# Altium schematic sheet air_cylinder_control.SchDoc
size A3; DocumentNumber: 9; Revision: V1.0; SheetNumber: 9; SheetTotal: 9; Rule: PcbType=ProtelPcb
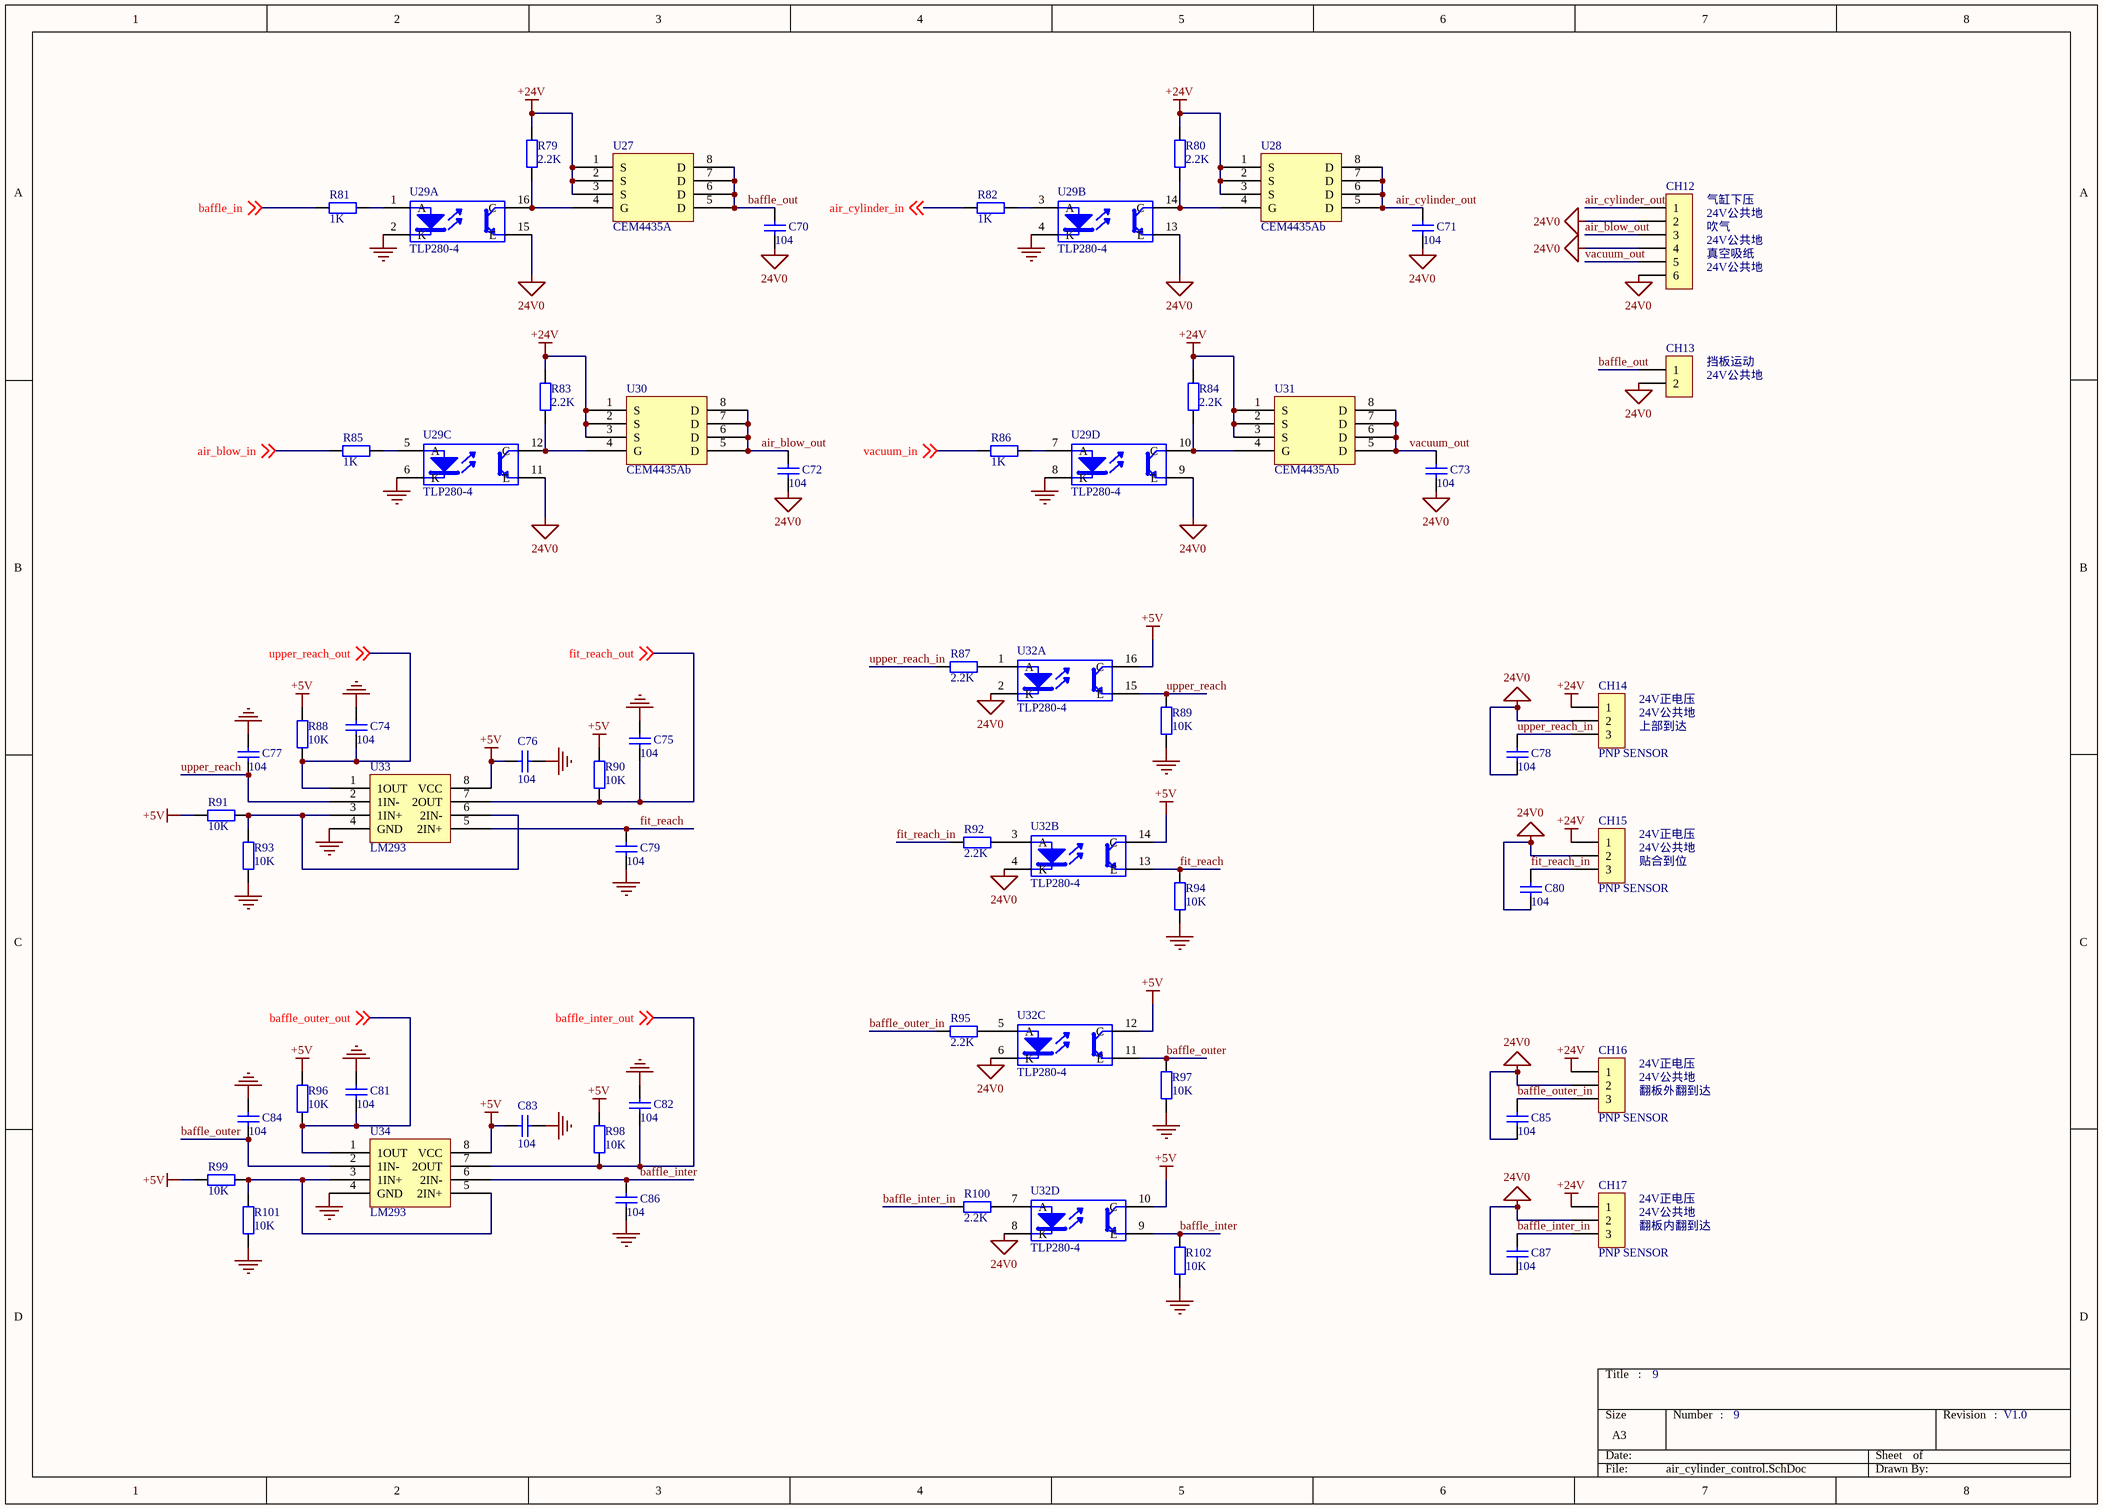
[diagram p0: air_cylinder_control.SchDoc]

## Parts
C70  value 104  [0805]  (hidden comment: Capb)
C71  value 104  [0805]  (hidden comment: Capb)
C72  value 104  [0805]  (hidden comment: Capb)
C73  value 104  [0805]  (hidden comment: Capb)
C74  value 104  [0805]  (hidden comment: Cap)
C75  value 104  [0805]  (hidden comment: Cap)
C76  value 104  [0805]  (hidden comment: Cap)
C77  value 104  [0805]  (hidden comment: Cap)
C78  value 104  [0805]  (hidden comment: Capb)
C79  value 104  [0805]  (hidden comment: Cap)
C80  value 104  [0805]  (hidden comment: Capb)
C81  value 104  [0805]  (hidden comment: Cap)
C82  value 104  [0805]  (hidden comment: Cap)
C83  value 104  [0805]  (hidden comment: Cap)
C84  value 104  [0805]  (hidden comment: Cap)
C85  value 104  [0805]  (hidden comment: Capb)
C86  value 104  [0805]  (hidden comment: Cap)
C87  value 104  [0805]  (hidden comment: Capb)
CH12  HEADER1X6  [CH3.96-6PIN]  (value not drawn)
CH13  HEADER1X2  [CH3.96-2PIN]  (value not drawn)
CH14  HEADER1X3  [CH3.96-3PIN]  (value not drawn)
CH15  HEADER1X3  [CH3.96-3PIN]  (value not drawn)
CH16  HEADER1X3  [CH3.96-3PIN]  (value not drawn)
CH17  HEADER1X3  [CH3.96-3PIN]  (value not drawn)
R79  value 2.2K  [0805]  (hidden comment: Res2)
R80  value 2.2K  [0805]  (hidden comment: Res2)
R81  value 1K  [0805]  (hidden comment: Res2)
R82  value 1K  [0805]  (hidden comment: Res2)
R83  value 2.2K  [0805]  (hidden comment: Res2)
R84  value 2.2K  [0805]  (hidden comment: Res2)
R85  value 1K  [0805]  (hidden comment: Res2)
R86  value 1K  [0805]  (hidden comment: Res2)
R87  value 2.2K  [0805]  (hidden comment: Res2)
R88  value 10K  [0805]  (hidden comment: Res2)
R89  value 10K  [0805]  (hidden comment: Res2)
R90  value 10K  [0805]  (hidden comment: Res2)
R91  value 10K  [0805]  (hidden comment: Res2)
R92  value 2.2K  [0805]  (hidden comment: Res2)
R93  value 10K  [0805]  (hidden comment: Res2)
R94  value 10K  [0805]  (hidden comment: Res2)
R95  value 2.2K  [0805]  (hidden comment: Res2)
R96  value 10K  [0805]  (hidden comment: Res2)
R97  value 10K  [0805]  (hidden comment: Res2)
R98  value 10K  [0805]  (hidden comment: Res2)
R99  value 10K  [0805]  (hidden comment: Res2)
R100  value 2.2K  [0805]  (hidden comment: Res2)
R101  value 10K  [0805]  (hidden comment: Res2)
R102  value 10K  [0805]  (hidden comment: Res2)
U27  CEM4435A  [SOP8-OP27]
U28  CEM4435Ab  [SOP8-OP27]
U29  TLP280-4  [SO16]  (parts A,B,C,D of 4)
U30  CEM4435Ab  [SOP8-OP27]
U31  CEM4435Ab  [SOP8-OP27]
U32  TLP280-4  [SO16]  (parts A,B,C,D of 4)
U33  LM293  [SOP8-OP27]
U34  LM293  [SOP8-OP27]

## Nets
24V0: C70.1 C71.1 C72.1 C73.1 C78.1 C80.1 C85.1 C87.1 CH12.2 CH12.4 CH12.6 CH13.2 CH14.2 CH15.2 CH16.2 CH17.2 U29.9(E) U29.11(E) U29.13(E) U29.15(E) U32.2(K) U32.4(K) U32.6(K) U32.8(K)
+5V: C76.2 C83.2 R88.2 R90.2 R91.2 R96.2 R98.2 R99.2 U32.10(C) U32.12(C) U32.14(C) U32.16(C) U33.8(VCC) U34.8(VCC)
+24V: CH14.1 CH15.1 CH16.1 CH17.1 R79.1 R80.1 R83.1 R84.1 U27.1(S) U27.2(S) U27.3(S) U28.1(S) U28.2(S) U28.3(S) U30.1(S) U30.2(S) U30.3(S) U31.1(S) U31.2(S) U31.3(S)
GND: C74.2 C75.2 C76.1 C77.2 C79.1 C81.2 C82.2 C83.1 C84.2 C86.1 R89.1 R93.1 R94.1 R97.1 R101.1 R102.1 U29.2(K) U29.4(K) U29.6(K) U29.8(K) U33.4(GND) U34.4(GND)
air_blow_in: R85.1 ; off-sheet air_blow_in
air_blow_out: C72.2 CH12.3 U30.5(D) U30.6(D) U30.7(D) U30.8(D)
air_cylinder_in: R82.1 ; off-sheet air_cylinder_in
air_cylinder_out: C71.2 CH12.1 U28.5(D) U28.6(D) U28.7(D) U28.8(D)
baffle_in: R81.1 ; off-sheet baffle_in
baffle_inter: C86.2 R102.2 U32.9(E) U34.6(2IN-)
baffle_inter_in: C87.2 CH17.3 R100.1
baffle_inter_out: C82.1 R98.1 U34.7(2OUT) ; off-sheet baffle_inter_out
baffle_out: C70.2 CH13.1 U27.5(D) U27.6(D) U27.7(D) U27.8(D)
baffle_outer: C84.1 R97.2 U32.11(E) U34.2(1IN-)
baffle_outer_in: C85.2 CH16.3 R95.1
baffle_outer_out: C81.1 R96.1 U34.1(1OUT) ; off-sheet baffle_outer_out
fit_reach: C79.2 R94.2 U32.13(E) U33.5(2IN+)
fit_reach_in: C80.2 CH15.3 R92.1
fit_reach_out: C75.1 R90.1 U33.7(2OUT) ; off-sheet fit_reach_out
upper_reach: C77.1 R89.2 U32.15(E) U33.2(1IN-)
upper_reach_in: C78.2 CH14.3 R87.1
upper_reach_out: C74.1 R88.1 U33.1(1OUT) ; off-sheet upper_reach_out
vacuum_in: R86.1 ; off-sheet vacuum_in
vacuum_out: C73.2 CH12.5 U31.5(D) U31.6(D) U31.7(D) U31.8(D)
NetR79_2: R79.2 U27.4(G) U29.16(C)
NetR80_2: R80.2 U28.4(G) U29.14(C)
NetR81_2: R81.2 U29.1(A)
NetR82_2: R82.2 U29.3(A)
NetR83_2: R83.2 U29.12(C) U30.4(G)
NetR84_2: R84.2 U29.10(C) U31.4(G)
NetR85_2: R85.2 U29.5(A)
NetR86_2: R86.2 U29.7(A)
NetR87_2: R87.2 U32.1(A)
NetR91_1: R91.1 R93.2 U33.3(1IN+) U33.6(2IN-)
NetR92_2: R92.2 U32.3(A)
NetR95_2: R95.2 U32.5(A)
NetR99_1: R99.1 R101.2 U34.3(1IN+) U34.5(2IN+)
NetR100_2: R100.2 U32.7(A)

## Notes on the sheet
- (near CH12) 气缸下压
- (near CH12) 吹气
- (near CH12) 24V公共地
- (near CH12) 真空吸纸
- (near CH13) 挡板运动
- (near CH13) 24V公共地
- (near CH14) 24V公共地
- (near CH14) 24V正电压
- (near CH14) 上部到达
- (near CH15) 24V公共地
- (near CH15) 24V正电压
- (near CH15) 贴合到位
- (near CH16) 翻板外翻到达
- (near CH16) 24V公共地
- (near CH16) 24V正电压
- (near CH17) 24V公共地
- (near CH17) 翻板内翻到达
- (near CH17) 24V正电压
- :
- (in symbol HEADER1X3) PNP SENSOR

## Library data of the parts
C70-C87 = Cap: Capacitor; Published: 8-Jun-2000; LatestRevisionDate: 17-Jul-2002; LatestRevisionNote: Re-released for DXP Platform.; PackageReference: RAD-0.3; Publisher: Altium Limited
R79-R102 = Res2: Resistor; Published: 8-Jun-2000; LatestRevisionDate: 17-Jul-2002; LatestRevisionNote: Re-released for DXP Platform.; PackageReference: AXIAL-0.4; Publisher: Altium Limited
U28 U30 U31 = CEM4435A
U29 U32 = TLP521-4